# Altium schematic sheet SPI-遥控.SCHDOC
size B; SheetNumber: 0; SheetTotal: 0; PageSetup: Record=PageOptions|CenterHorizontal=True|CenterVertical=True|PrintScale=0.73|XCorrection=1.00|YCorrection=1.00|PrintKind=2|BorderSize=5000000|LeftOffset=0|BottomOffset=0|Orientation=2|PaperLength=1000|PaperWidth=1000|Scale=100|PaperSource=1|PrintQuality=300|MediaType=1|DitherType=10|PaperKind=A4|PrintScaleMode=1
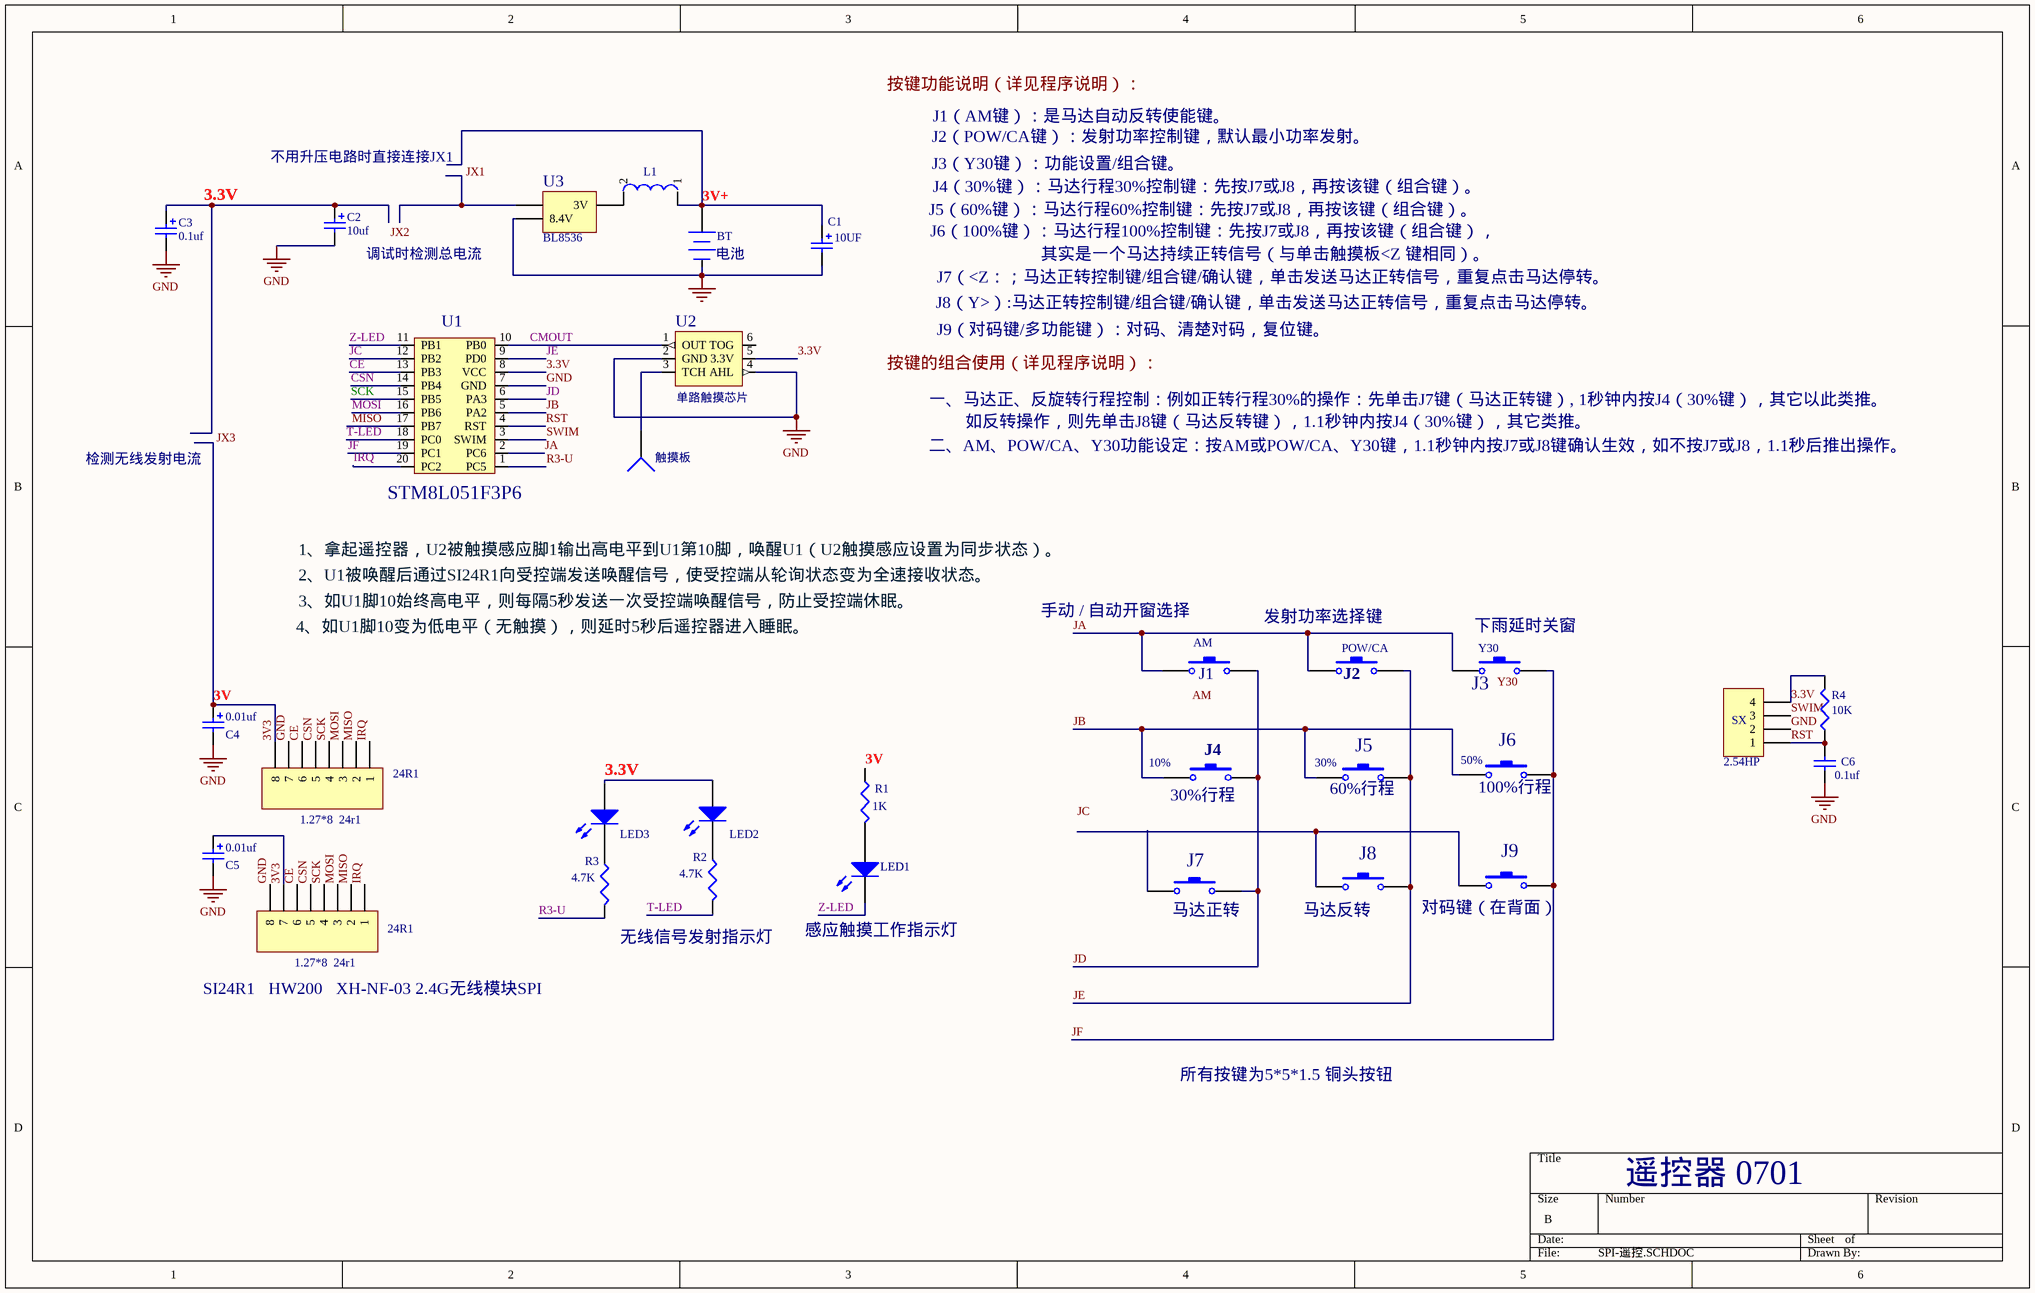
[diagram p0: SPI-遥控.SCHDOC]

## Parts
(Parts that share a designator on the sheet are numbered #1, #2 ... from top to bottom, then left to right.)
10%  J4  [SPST-2]
24R1#1  1.27*8  24r1  [HDR1X8]
24R1#2  1.27*8  24r1  [HDR1X8]
30%  J5  [SPST-2]
50%  J6  [SPST-2]
?  触摸板  [PIN1]
AM  J1  [SPST-2]
BT  3V  [BAT-2]  (value not drawn)
C1  10UF  [CC2012-0805]
C2  10uf  [CC2012-0805]
C3  0.1uf  [CC2012-0805]
C4  0.01uf  [CC2012-0805]
C5  0.01uf  [CC2012-0805]
C6  value 0.1uf  [CC1608-0603]  (hidden comment: Cap Semi)
L1  (no value)  [L7]
LED1  LED  [LED-1]
LED2  LED  [LED-1]  (value not drawn)
LED3  LED  [LED-1]  (value not drawn)
POW/CA  J2  [SPST-2]
R1  value 1K  [C1608-0603]
R2  value 4.7K  [C1608-0603]
R3  value 4.7K  [C1608-0603]
R4  value 10K  [C1608-0603]
SX  2.54HP  [HDR1X4]
U1  STM8L051F3P6  [TSSOP20]
U2  单路触摸芯片  [2308]
U3  BL8536  [MHDR2X2]
Y30  J3  [SPST-2]
对码键（在背面）  J9  [SPST-2]
马达反转  J8  [SPST-2]
马达正转  J7  [SPST-2]

## Nets
GND: 24R1#1.7 24R1#2.8 C1.2 C2.2 C3.2 C4.2 C5.2 C6.1 SX.2 U1.7(GND) U2.2(GND) U2.4(AHL) U3.3.3_IN(8.4V)
3.3V: C2.1 C3.1 LED2.1(A) LED3.1(A) R4.2 SX.4 U1.8(VCC) U2.5(3.3V)
3V: 24R1#1.8 24R1#2.7 C4.1 C5.1 R1.1  [also labelled 3V3]
3V+: BT.1(+) C1.1 L1.1
CE: 24R1#1.6 24R1#2.6 U1.13(PB3)
CMOUT: U1.10(PB0) U2.1(OUT)
CSN: 24R1#1.5 24R1#2.5 U1.14(PB4)
IRQ: 24R1#1.1 24R1#2.1 U1.20(PC2)
JA: AM.1 POW/CA.1 U1.2(PC6) Y30.1
JB: 10%.1 30%.1 50%.1 U1.5(PA2)
JC: U1.12(PB2)
JD: 10%.2 AM.2 U1.6(PA3) 马达正转.2
JE: 30%.2 POW/CA.2 U1.9(PD0) 马达反转.2
JF: 50%.2 U1.19(PC1) Y30.2 对码键（在背面）.2
MISO: 24R1#1.2 24R1#2.2 U1.17(PB7)
MOSI: 24R1#1.3 24R1#2.3 U1.16(PB6)
R3-U: R3.2 U1.1(PC5)
RST: C6.2 R4.1 SX.1 U1.4(RST)
SCK: 24R1#1.4 24R1#2.4 U1.15(PB5)
SWIM: SX.3 U1.3(SWIM)
T-LED: R2.2 U1.18(PC0)
Z-LED: LED1.2(K) U1.11(PB1)
Net?_1: ?.1 U2.3(TCH)
NetL1_2: L1.2 U3.2(3V)
NetLED1_1: LED1.1(A) R1.2
NetLED3_2: LED3.2(K) R3.1
Net对码键（在背面）_1: 对码键（在背面）.1 马达反转.1

Not connected (* = marked no-connect by the designer): BT 2(-); LED2 2(K); R2 1; U2 6(TOG); U3 3.3OUT; 马达正转 1

## Notes on the sheet
- 按键功能说明（详见程序说明）：
- (near C2) 不用升压电路时直接连接JX1
- J2（POW/CA键）：发射功率控制键，默认最小功率发射。
- J1（AM键）：是马达自动反转使能键。
- J5（60%键）：马达行程60%控制键：先按J7或J8，再按该键（组合键）。
- J6（100%键）：马达行程100%控制键：先按J7或J8，再按该键（组合键），
- J3（Y30键）：功能设置/组合键。
- J4（30%键）：马达行程30%控制键：先按J7或J8，再按该键（组合键）。
- (near C2) 调试时检测总电流
- (near BT) 电池
- J7（<Z：；马达正转控制键/组合键/确认键，单击发送马达正转信号，重复点击马达停转。
- 其实是一个马达持续正转信号（与单击触摸板<Z 键相同）。
- 按键的组合使用（详见程序说明）：
- J8（Y>）:马达正转控制键/组合键/确认键，单击发送马达正转信号，重复点击马达停转。
- J9（对码键/多功能键）：对码、清楚对码，复位键。
- 一、马达正、反旋转行程控制：例如正转行程30%的操作：先单击J7键（马达正转键）, 1秒钟内按J4（30%键），其它以此类推。
- 如反转操作，则先单击J8键（马达反转键），1.1秒钟内按J4（30%键），其它类推。
- 检测无线发射电流
- 二、AM、POW/CA、Y30功能设定：按AM或POW/CA、Y30键，1.1秒钟内按J7或J8键确认生效，如不按J7或J8，1.1秒后推出操作。
- 1、拿起遥控器，U2被触摸感应脚1输出高电平到U1第10脚，唤醒U1（U2触摸感应设置为同步状态）。
- 4、如U1脚10变为低电平（无触摸），则延时5秒后遥控器进入睡眠。
- 2、U1被唤醒后通过SI24R1向受控端发送唤醒信号，使受控端从轮询状态变为全速接收状态。
- 3、如U1脚10始终高电平，则每隔5秒发送一次受控端唤醒信号，防止受控端休眠。
- 手动 / 自动开窗选择
- 发射功率选择键
- (near Y30) 下雨延时关窗
- (near 10%) 30%行程
- (near 30%) 60%行程
- (near 50%) 100%行程
- 无线信号发射指示灯
- (near LED1) 感应触摸工作指示灯
- SI24R1   HW200   XH-NF-03 2.4G无线模块SPI
- 所有按键为5*5*1.5 铜头按钮
- 遥控器 0701
- Labels drawn without touching a wire or pin: AM, JC, JX1, JX2, JX3, Y30

## Library data of the parts
10% 30% 50% AM POW/CA Y30 对码键（在背面） 马达反转 马达正转 = SW-PB: Switch; Published: 24-Mar-1999; LatestRevisionDate: 17-Jul-2002; LatestRevisionNote: Re-released for DXP Platform.; Publisher: Altium Limited
24R1#1 24R1#2 = Header 8: Header, 8-Pin; LatestRevisionDate: 17-Jul-2002; LatestRevisionNote: Re-released for DXP Platform.; Publisher: Altium Limited
? = Socket: LatestRevisionDate: 17-Jul-2002; LatestRevisionNote: Re-released for DXP Platform.; Publisher: Altium Limited
BT = Battery: Multicell Battery; Published: 24-Mar-1999; LatestRevisionDate: 17-Jul-2002; LatestRevisionNote: Re-released for DXP Platform.; Publisher: Altium Limited
C1-C5 = Cap Pol3: Polarized Capacitor (Surface Mount); Published: 8-Jun-2000; LatestRevisionDate: 17-Jul-2002; LatestRevisionNote: Re-released for DXP Platform.; Publisher: Altium Limited; PackageReference: C0805
C6 = Cap Semi: Capacitor (Semiconductor SIM Model); Published: 8-Jun-2000; LatestRevisionDate: 17-Jul-2002; LatestRevisionNote: Re-released for DXP Platform.; PackageReference: C1206; Publisher: Altium Limited
L1 = L
LED1-LED3 = LED1: Typical RED GaAs LED; Published: 8-Jun-2000; LatestRevisionDate: 17-Jul-2002; LatestRevisionNote: Re-released for DXP Platform.; Publisher: Altium Limited
R1-R4 = Res3: Resistor; Published: 8-Jun-2000; LatestRevisionDate: 17-Jul-2002; LatestRevisionNote: Re-released for DXP Platform.; Publisher: Altium Limited
SX = Header 4: Header, 4-Pin; LatestRevisionDate: 17-Jul-2002; LatestRevisionNote: Re-released for DXP Platform.; Publisher: Altium Limited
U1 = STM8L051
U2 = 1308
U3 = MHDR2X2: Header, 2-Pin, Dual row; LatestRevisionDate: 17-Jul-2002; LatestRevisionNote: Re-released for DXP Platform.; Publisher: Altium Limited